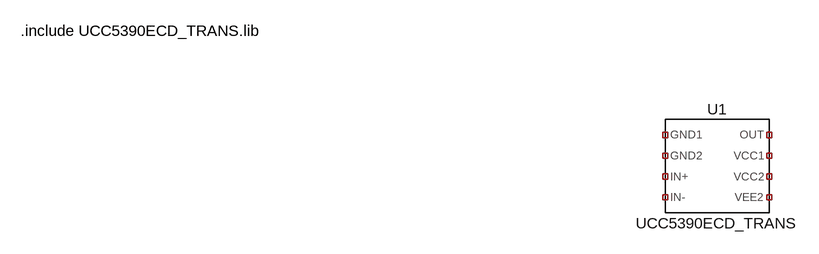
[diagram p0: schematic Draft9.asc]
Draft9.asc, the LTspice schematic file:
Version 4.1
SHEET 1 1072 680
SYMBOL UCC5390ECD_TRANS 944 240 R0
SYMATTR InstName U1
TEXT -128 32 Left 2 !.include UCC5390ECD_TRANS.lib

The netlist it stands for:
* Draft9.asc
X§U1 NC_01 NC_02 NC_03 NC_04 NC_05 NC_06 NC_07 NC_08 UCC5390ECD_TRANS  ; pins GND1 GND2 IN+ IN- OUT VCC1 VCC2 VEE2
.include UCC5390ECD_TRANS.lib
.lib UCC5390ECD_TRANS.LIB
.backanno
.end